# EAGLE design buckler (EAGLE 9.1.1)
AUTHOR: Branden Ghena; REV: B; TITLE: Berkeley Buckler

## Sheet 1 of 3: Headers
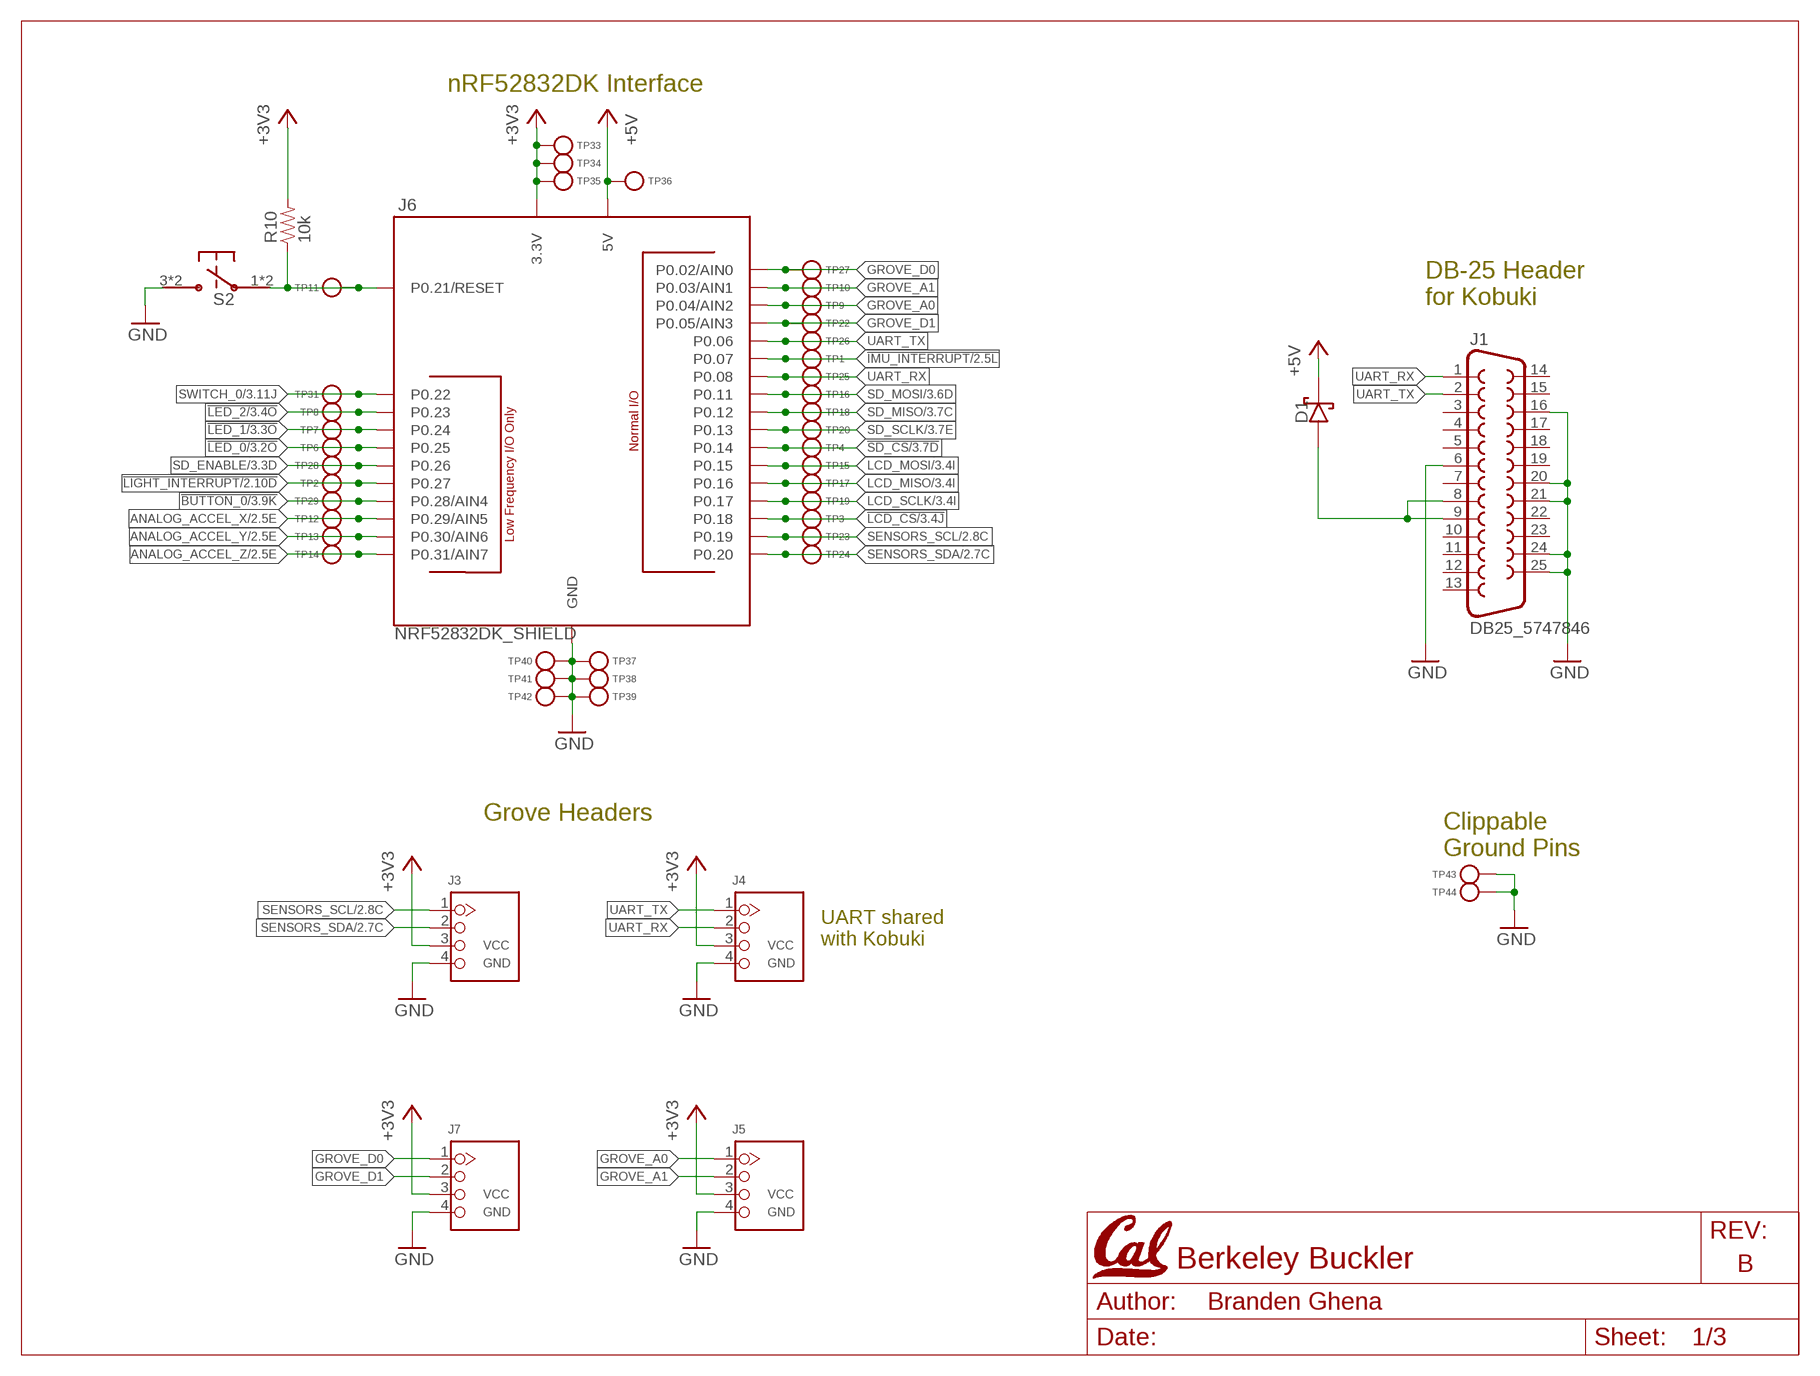
[diagram p0: schematic, sheet 1]
U$1 (LETTER_L_CAL): HEIGHT: 8.5in; WIDTH: 11in

### Parts
D1  DIODE_SCHOTTKYSOD323  [SOD323]
J1  DB25_5747846  [DB25_5747846]
J3  4P-2.0  GROVE-CONNECTOR-DIP(4P-2.0)  [HW4-2.0]
J4  4P-2.0  GROVE-CONNECTOR-DIP(4P-2.0)  [HW4-2.0]
J5  4P-2.0  GROVE-CONNECTOR-DIP(4P-2.0)  [HW4-2.0]
J6  NRF52832DK_SHIELD  [NRF52832DK_SHIELD]
J7  4P-2.0  GROVE-CONNECTOR-DIP(4P-2.0)  [HW4-2.0]
R10  10k  RESISTOR0402_RES  [0402_RES]
S2  PTS645SM43SMTR92  [PTS645]
TP1  TEST_POINT_0.040IN  [TESTPOINT_0.040IN]
TP2  TEST_POINT_0.040IN  [TESTPOINT_0.040IN]
TP3  TEST_POINT_0.040IN  [TESTPOINT_0.040IN]
TP4  TEST_POINT_0.040IN  [TESTPOINT_0.040IN]
TP6  TEST_POINT_0.040IN  [TESTPOINT_0.040IN]
TP7  TEST_POINT_0.040IN  [TESTPOINT_0.040IN]
TP8  TEST_POINT_0.040IN  [TESTPOINT_0.040IN]
TP9  TEST_POINT_0.040IN  [TESTPOINT_0.040IN]
TP10  TEST_POINT_0.040IN  [TESTPOINT_0.040IN]
TP11  TEST_POINT_0.040IN  [TESTPOINT_0.040IN]
TP12  TEST_POINT_0.040IN  [TESTPOINT_0.040IN]
TP13  TEST_POINT_0.040IN  [TESTPOINT_0.040IN]
TP14  TEST_POINT_0.040IN  [TESTPOINT_0.040IN]
TP15  TEST_POINT_0.040IN  [TESTPOINT_0.040IN]
TP16  TEST_POINT_0.040IN  [TESTPOINT_0.040IN]
TP17  TEST_POINT_0.040IN  [TESTPOINT_0.040IN]
TP18  TEST_POINT_0.040IN  [TESTPOINT_0.040IN]
TP19  TEST_POINT_0.040IN  [TESTPOINT_0.040IN]
TP20  TEST_POINT_0.040IN  [TESTPOINT_0.040IN]
TP22  TEST_POINT_0.040IN  [TESTPOINT_0.040IN]
TP23  TEST_POINT_0.040IN  [TESTPOINT_0.040IN]
TP24  TEST_POINT_0.040IN  [TESTPOINT_0.040IN]
TP25  TEST_POINT_0.040IN  [TESTPOINT_0.040IN]
TP26  TEST_POINT_0.040IN  [TESTPOINT_0.040IN]
TP27  TEST_POINT_0.040IN  [TESTPOINT_0.040IN]
TP28  TEST_POINT_0.040IN  [TESTPOINT_0.040IN]
TP29  TEST_POINT_0.040IN  [TESTPOINT_0.040IN]
TP31  TEST_POINT_0.040IN  [TESTPOINT_0.040IN]
TP33  TEST_POINT_0.040IN  [TESTPOINT_0.040IN]
TP34  TEST_POINT_0.040IN  [TESTPOINT_0.040IN]
TP35  TEST_POINT_0.040IN  [TESTPOINT_0.040IN]
TP36  TEST_POINT_0.040IN  [TESTPOINT_0.040IN]
TP37  TEST_POINT_0.040IN  [TESTPOINT_0.040IN]
TP38  TEST_POINT_0.040IN  [TESTPOINT_0.040IN]
TP39  TEST_POINT_0.040IN  [TESTPOINT_0.040IN]
TP40  TEST_POINT_0.040IN  [TESTPOINT_0.040IN]
TP41  TEST_POINT_0.040IN  [TESTPOINT_0.040IN]
TP42  TEST_POINT_0.040IN  [TESTPOINT_0.040IN]
TP43  TEST_POINT_0.078IN  [TESTPOINT_0.078IN]
TP44  TEST_POINT_0.078IN  [TESTPOINT_0.078IN]

### Nets
5V_IN: D1.P$2(ANODE) J1.8 J1.9
!BUTTON_0: J6.P0.28(P0.28/AIN4) TP29.TESTPOINT ; also sheet 3
!IMU_INTERRUPT: J6.P0.07 TP1.TESTPOINT ; also sheet 2
!LCD_CS: J6.P0.18 TP3.TESTPOINT ; also sheet 3
!LED_0: J6.P0.25 TP6.TESTPOINT ; also sheet 3
!LED_1: J6.P0.24 TP7.TESTPOINT ; also sheet 3
!LED_2: J6.P0.23 TP8.TESTPOINT ; also sheet 3
!LIGHT_INTERRUPT: J6.P0.27 TP2.TESTPOINT ; also sheet 2
!RESET: J6.P0.21(P0.21/RESET) R10.1 S2.1 S2.2 TP11.TESTPOINT
!SD_CS: J6.P0.14 TP4.TESTPOINT ; also sheet 3
+3V3: J3.3 J4.3 J5.3 J6.3.3V@0(3.3V) J6.3.3V@1(3.3V) J6.3.3V@2(3.3V) J7.3 R10.2 TP33.TESTPOINT TP34.TESTPOINT TP35.TESTPOINT ; also sheet 2,3
+5V: D1.P$1(CATHODE) J6.5V TP36.TESTPOINT
ANALOG_ACCEL_X: J6.P0.29(P0.29/AIN5) TP12.TESTPOINT ; also sheet 2
ANALOG_ACCEL_Y: J6.P0.30(P0.30/AIN6) TP13.TESTPOINT ; also sheet 2
ANALOG_ACCEL_Z: J6.P0.31(P0.31/AIN7) TP14.TESTPOINT ; also sheet 2
GND: J1.6 J1.16 J1.20 J1.21 J1.24 J1.25 J3.4 J4.4 J5.4 J6.GND@0(GND) J6.GND@1(GND) J6.GND@2(GND) J7.4 S2.3 S2.4 TP37.TESTPOINT TP38.TESTPOINT TP39.TESTPOINT TP40.TESTPOINT TP41.TESTPOINT TP42.TESTPOINT TP43.1(TESTPOINT) TP44.1(TESTPOINT) ; also sheet 2,3
GROVE_A0: J5.1 J6.P0.04(P0.04/AIN2) TP9.TESTPOINT
GROVE_A1: J5.2 J6.P0.03(P0.03/AIN1) TP10.TESTPOINT
GROVE_D0: J6.P0.02(P0.02/AIN0) J7.1 TP27.TESTPOINT
GROVE_D1: J6.P0.05(P0.05/AIN3) J7.2 TP22.TESTPOINT
LCD_MISO: J6.P0.16 TP17.TESTPOINT ; also sheet 3
LCD_MOSI: J6.P0.15 TP15.TESTPOINT ; also sheet 3
LCD_SCLK: J6.P0.17 TP19.TESTPOINT ; also sheet 3
SD_ENABLE: J6.P0.26 TP28.TESTPOINT ; also sheet 3
SD_MISO: J6.P0.12 TP18.TESTPOINT ; also sheet 3
SD_MOSI: J6.P0.11 TP16.TESTPOINT ; also sheet 3
SD_SCLK: J6.P0.13 TP20.TESTPOINT ; also sheet 3
SENSORS_SCL: J3.1 J6.P0.19 TP23.TESTPOINT ; also sheet 2
SENSORS_SDA: J3.2 J6.P0.20 TP24.TESTPOINT ; also sheet 2
SWITCH_0: J6.P0.22 TP31.TESTPOINT ; also sheet 3
UART_RX: J1.1 J4.2 J6.P0.08 TP25.TESTPOINT
UART_TX: J1.2 J4.1 J6.P0.06 TP26.TESTPOINT
Unconnected: J1.3 J1.4 J1.5 J1.7 J1.10 J1.11 J1.12 J1.13 J1.14 J1.15 J1.17 J1.18 J1.19 J1.22 J1.23

### Notes on the sheet
- nRF52832DK Interface
- DB-25 Header
  for Kobuki
- Grove Headers
- Clippable
  Ground Pins
- UART shared
  with Kobuki

## Sheet 2 of 3: Sensors
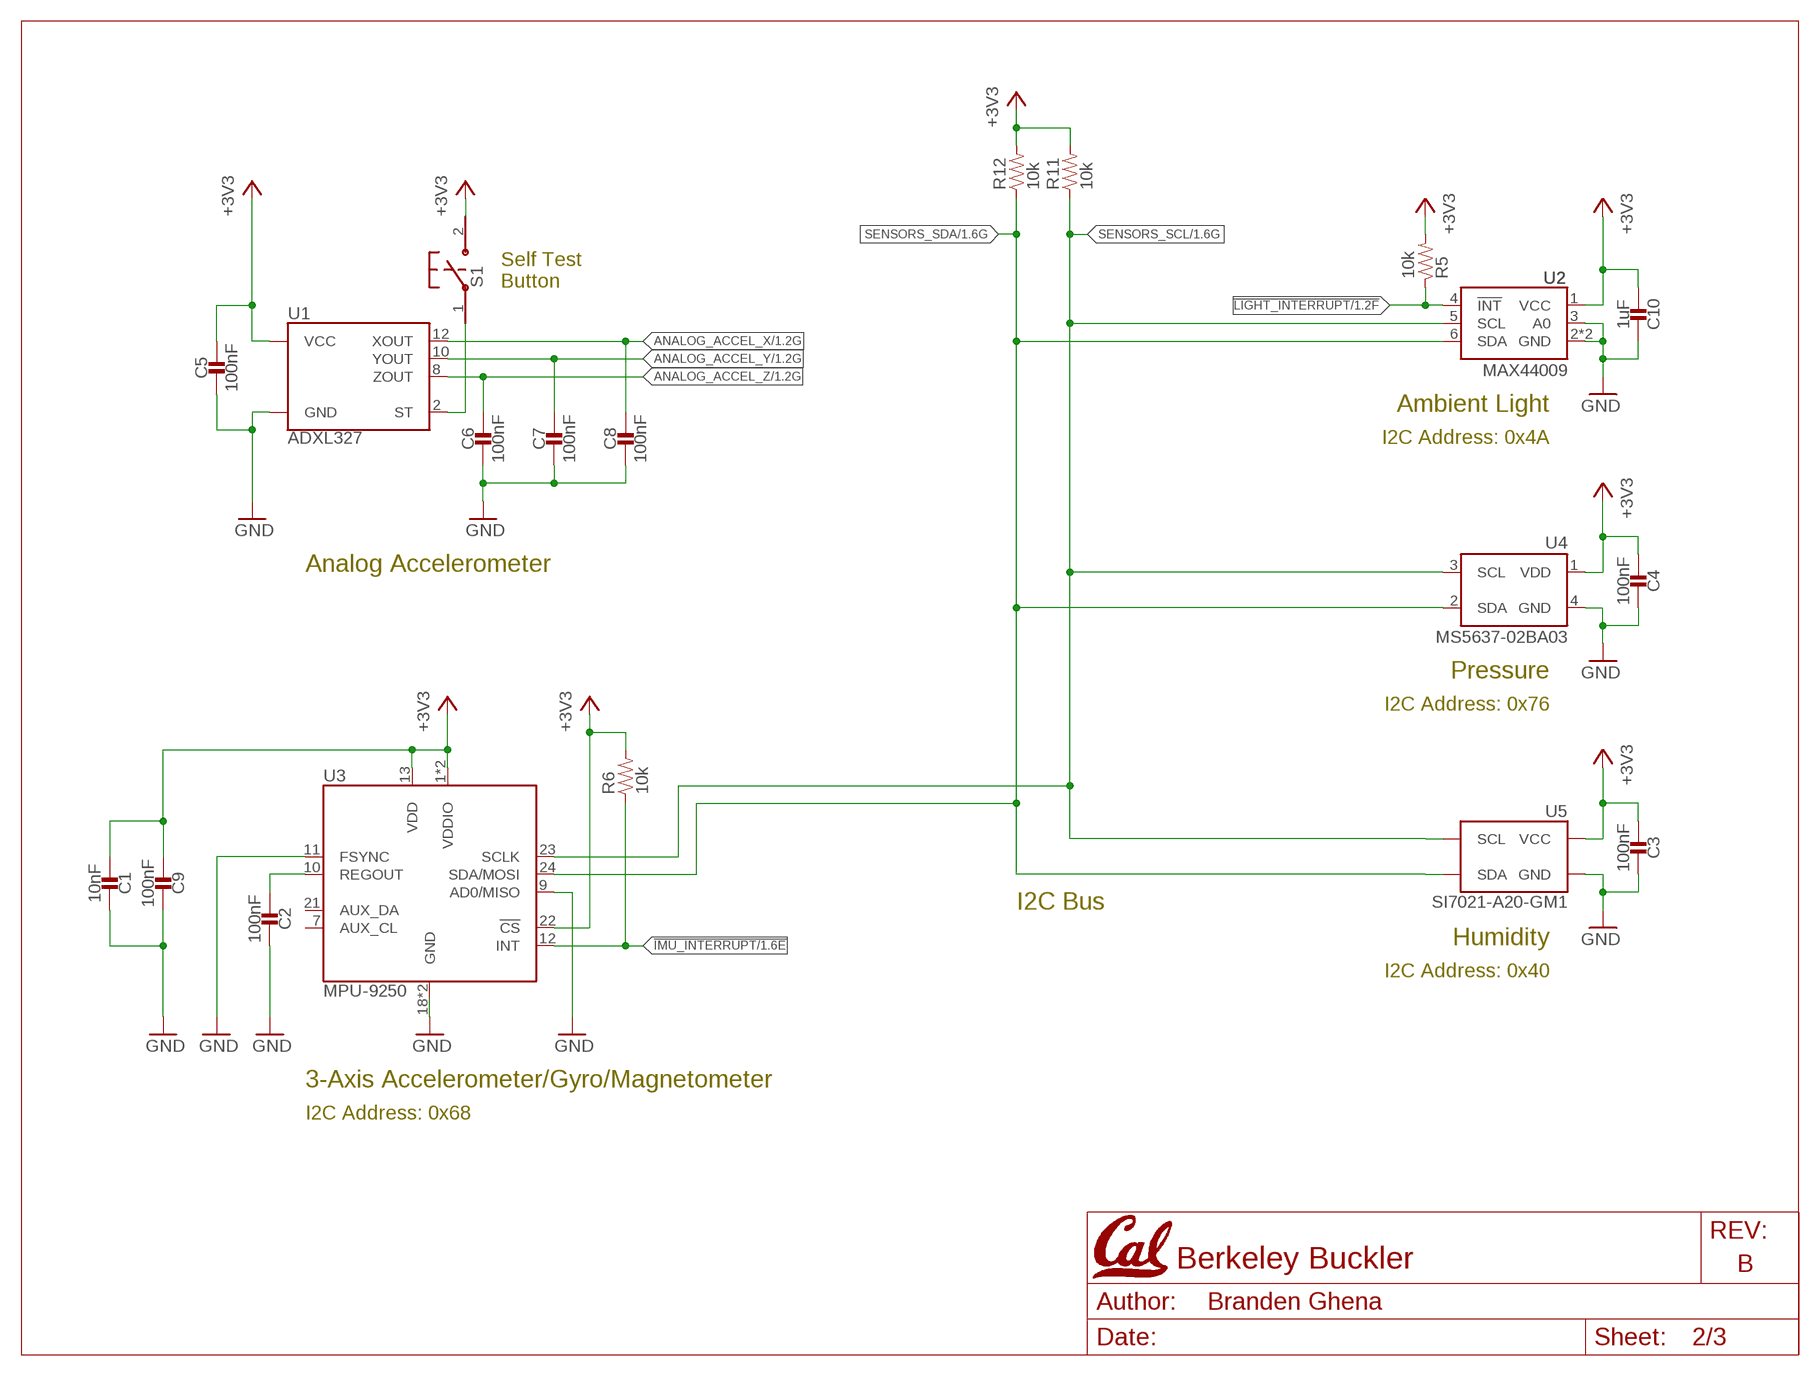
[diagram p1: schematic, sheet 2]
U$2 (LETTER_L_CAL): HEIGHT: 8.5in; WIDTH: 11in

### Parts
C1  10nF  CAPACITOR0402_CAP  [0402_CAP]
C2  100nF  CAPACITOR0402_CAP  [0402_CAP]
C3  100nF  CAPACITOR0402_CAP  [0402_CAP]
C4  100nF  CAPACITOR0402_CAP  [0402_CAP]
C5  100nF  CAPACITOR0402_CAP  [0402_CAP]
C6  100nF  CAPACITOR0402_CAP  [0402_CAP]
C7  100nF  CAPACITOR0402_CAP  [0402_CAP]
C8  100nF  CAPACITOR0402_CAP  [0402_CAP]
C9  100nF  CAPACITOR0402_CAP  [0402_CAP]
C10  1uF  CAPACITOR0402_CAP  [0402_CAP]
R5  10k  RESISTOR0402_RES  [0402_RES]
R6  10k  RESISTOR0402_RES  [0402_RES]
R11  10k  RESISTOR0402_RES  [0402_RES]
R12  10k  RESISTOR0402_RES  [0402_RES]
S1  B3U-1000P  [B3U-1000P]
U1  ADXL327  [LFCSP-16]
U2  MAX44009  [UDFN-6-EXPOSED]
U3  MPU-9250  [QFN-24/3MM]
U4  MS5637-02BA03  [4-SMD]
U5  SI7021-A20-GM1  [DFN-6/3MM]

### Nets
!IMU_INTERRUPT: R6.1 U3.12(INT) ; also sheet 1
!LIGHT_INTERRUPT: R5.1 U2.4(!INT) ; also sheet 1
+3V3: C1.1 C3.1 C4.1 C5.1 C9.1 C10.1 R5.2 R6.2 R11.2 R12.2 S1.2 U1.14(VCC) U1.15(VCC) U2.1(VCC) U3.1(VDDIO) U3.8(VDDIO) U3.13(VDD) U3.22(!CS) U4.1(VDD) U5.5(VCC) ; also sheet 1,3
ANALOG_ACCEL_X: C8.1 U1.12(XOUT) ; also sheet 1
ANALOG_ACCEL_Y: C7.1 U1.10(YOUT) ; also sheet 1
ANALOG_ACCEL_Z: C6.1 U1.8(ZOUT) ; also sheet 1
GND: C1.2 C2.2 C3.2 C4.2 C5.2 C6.2 C7.2 C8.2 C9.2 C10.2 U1.3(GND) U1.5(GND) U1.6(GND) U1.7(GND) U2.2(GND) U2.3(A0) U2.EP(GND) U3.9(AD0/MISO) U3.11(FSYNC) U3.18(GND) U3.20(GND) U4.4(GND) U5.2(GND) ; also sheet 1,3
N$7: S1.1 U1.2(ST)
N$19: C2.1 U3.10(REGOUT)
SENSORS_SCL: R11.1 U2.5(SCL) U3.23(SCLK) U4.3(SCL) U5.6(SCL) ; also sheet 1
SENSORS_SDA: R12.1 U2.6(SDA) U3.24(SDA/MOSI) U4.2(SDA) U5.1(SDA) ; also sheet 1
Unconnected: U3.7(AUX_CL) U3.21(AUX_DA)

### Notes on the sheet
- Self Test
  Button
- Ambient Light
- I2C Address: 0x4A
- Analog Accelerometer
- Pressure
- I2C Address: 0x76
- I2C Bus
- Humidity
- I2C Address: 0x40
- 3-Axis Accelerometer/Gyro/Magnetometer
- I2C Address: 0x68

## Sheet 3 of 3: Other Peripherals
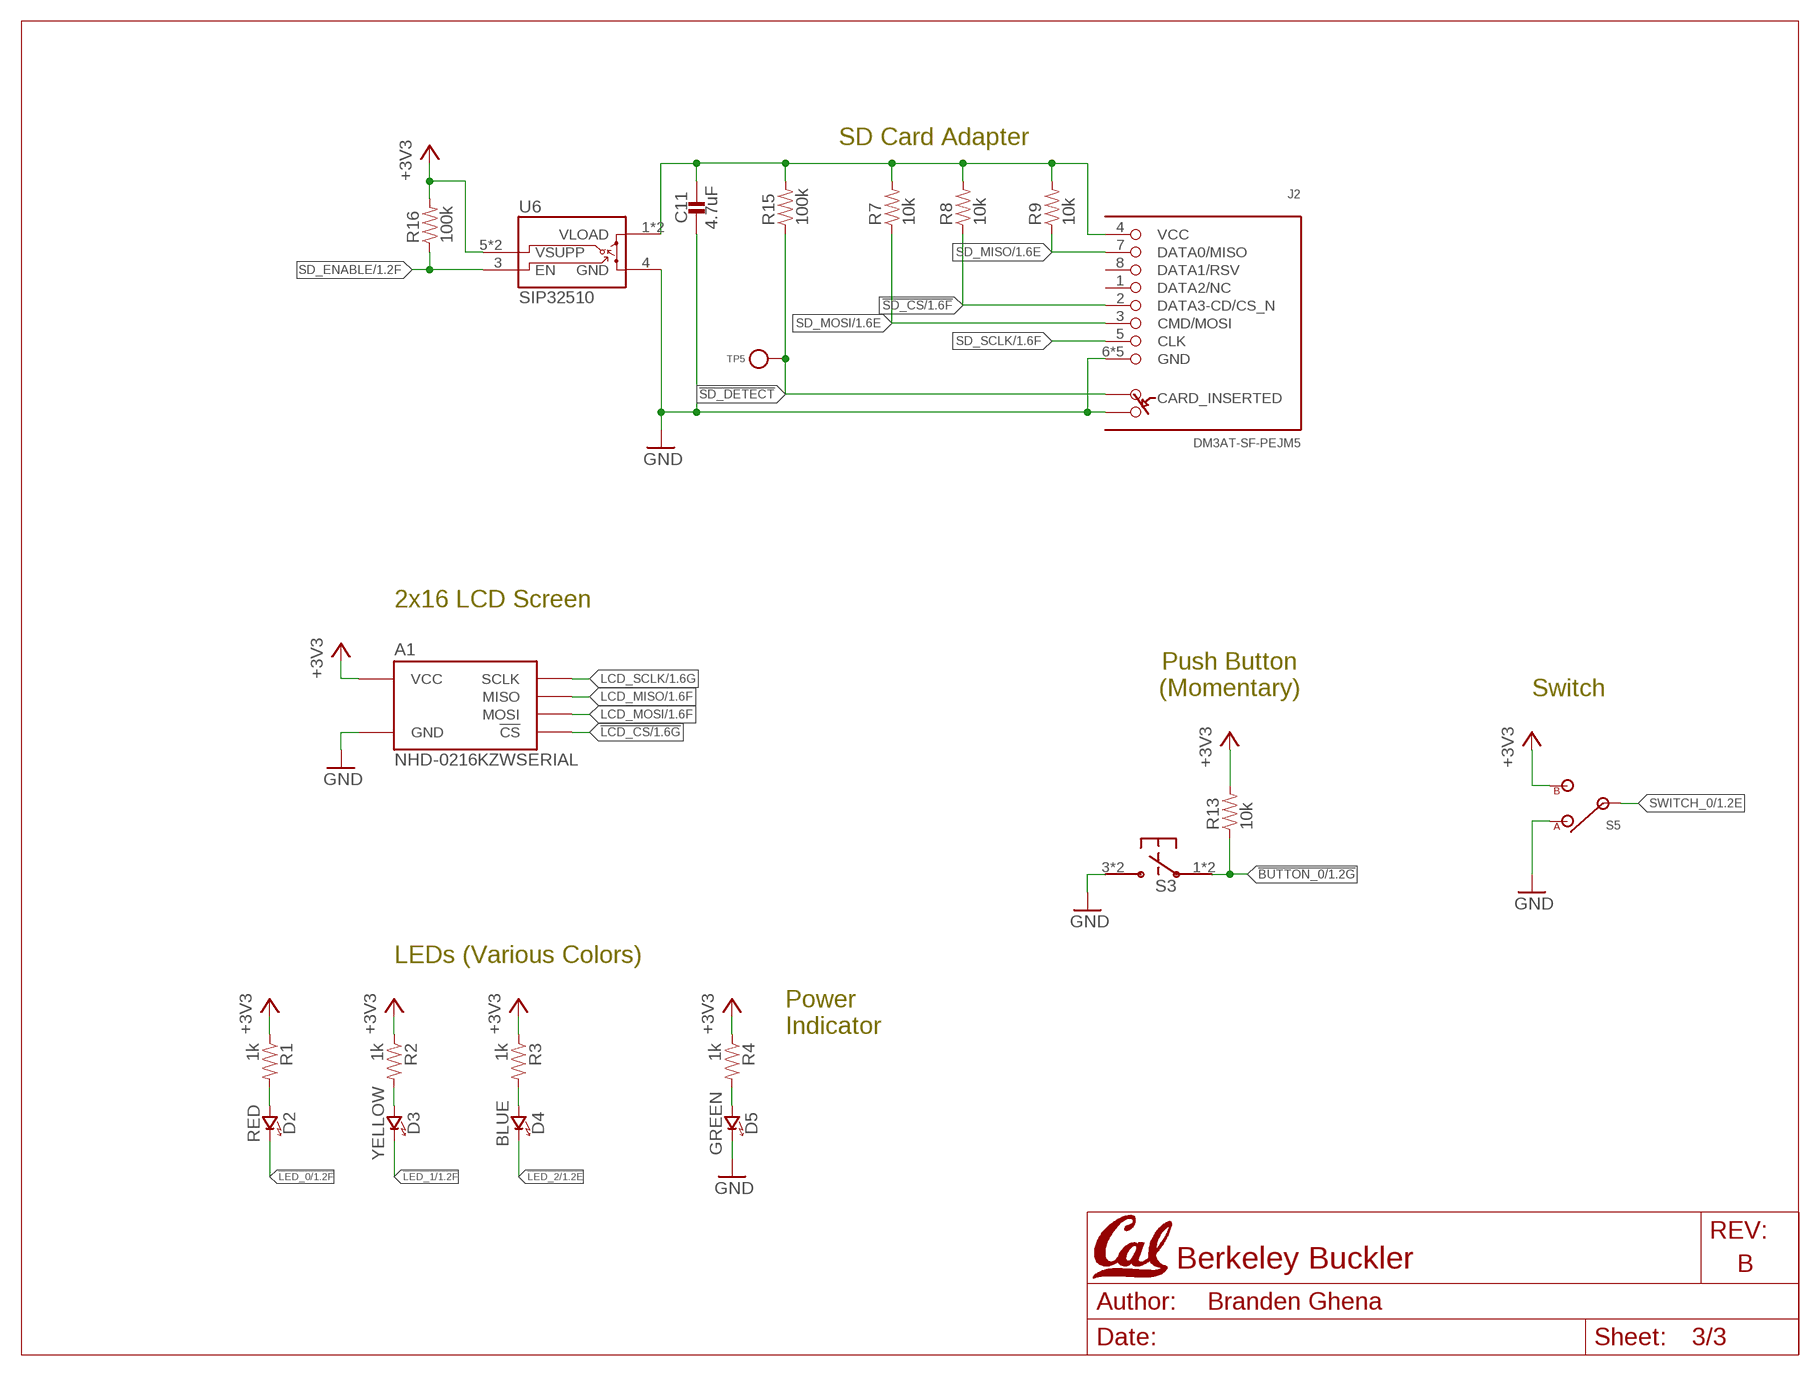
[diagram p2: schematic, sheet 3]
U$3 (LETTER_L_CAL): HEIGHT: 8.5in; WIDTH: 11in

### Parts
A1  NHD-0216KZWSERIAL  [NHD-0216KZW]
C11  4.7uF  CAPACITOR0402_CAP  [0402_CAP]
D2  RED  LED0603  [LED-0603]
D3  YELLOW  LED0603  [LED-0603]
D4  BLUE  LED0603  [LED-0603]
D5  GREEN  LED0603  [LED-0603]
J2  DM3AT-SF-PEJM5  [DM3AT-SF-PEJM5]
R1  1k  RESISTOR0402_RES  [0402_RES]
R2  1k  RESISTOR0402_RES  [0402_RES]
R3  1k  RESISTOR0402_RES  [0402_RES]
R4  1k  RESISTOR0402_RES  [0402_RES]
R7  10k  RESISTOR0402_RES  [0402_RES]
R8  10k  RESISTOR0402_RES  [0402_RES]
R9  10k  RESISTOR0402_RES  [0402_RES]
R13  10k  RESISTOR0402_RES  [0402_RES]
R15  100k  RESISTOR0402_RES  [0402_RES]
R16  100k  RESISTOR0402_RES  [0402_RES]
S3  PTS645SM43SMTR92  [PTS645]
S5  TE_SSA12/SPDT  [TE_SSA12/SPDT]
TP5  TEST_POINT_0.040IN  [TESTPOINT_0.040IN]
U6  SIP32510  [TSOT23-6]

### Nets
!BUTTON_0: R13.1 S3.1 S3.2 ; also sheet 1
!LCD_CS: A1.16(!CS) ; also sheet 1
!LED_0: D2.C(CATHODE) ; also sheet 1
!LED_1: D3.C(CATHODE) ; also sheet 1
!LED_2: D4.C(CATHODE) ; also sheet 1
!SD_CS: J2.2(DATA3-CD/CS_N) R8.1 ; also sheet 1
!SD_DETECT: J2.A R15.1 TP5.TESTPOINT
+3V3: A1.2(VCC) R1.1 R2.1 R3.1 R4.1 R13.2 R16.2 S5.2(B) U6.5(VSUPP) U6.6(VSUPP) ; also sheet 1,2
GND: A1.1(GND) C11.2 D5.C(CATHODE) J2.6(GND) J2.B J2.MOUNT0(GND) J2.MOUNT1(GND) J2.MOUNT2(GND) J2.MOUNT3(GND) S3.3 S3.4 S5.1(A) U6.4(GND) ; also sheet 1,2
LCD_MISO: A1.13(MISO) ; also sheet 1
LCD_MOSI: A1.14(MOSI) ; also sheet 1
LCD_SCLK: A1.12(SCLK) ; also sheet 1
N$3: D5.A(ANODE) R4.2
N$4: D4.A(ANODE) R3.2
N$5: D3.A(ANODE) R2.2
N$18: C11.1 J2.4(VCC) R7.2 R8.2 R9.2 R15.2 U6.1(VLOAD) U6.2(VLOAD)
N$25: D2.A(ANODE) R1.2
SD_ENABLE: R16.1 U6.3(EN) ; also sheet 1
SD_MISO: J2.7(DATA0/MISO) R9.1 ; also sheet 1
SD_MOSI: J2.3(CMD/MOSI) R7.1 ; also sheet 1
SD_SCLK: J2.5(CLK) ; also sheet 1
SWITCH_0: S5.IN ; also sheet 1
Unconnected: J2.1(DATA2/NC) J2.8(DATA1/RSV)

### Notes on the sheet
- SD Card Adapter
- 2x16 LCD Screen
- Push Button
  (Momentary)
- Switch
- LEDs (Various Colors)
- Power
  Indicator

## Library data of the parts
A1 = headers:NHD-0216KZW; DIGIKEY: NHD-0216KZW-AG5-ND,952-3305-ND; DIGIKEY1: NHD-0216KZW-AG5-ND; DIGIKEY2: 952-3305-ND
C1 = passives:CAPACITOR: SMD Capacitor; DESCRIPTION: CAP CER 10000PF 25V X7R 0402; DIGIKEY: 399-1279-1-ND; MANUFACTURER: KEMET; MPN: C0402C103J3RACTU
C2-C9 = passives:CAPACITOR: SMD Capacitor; DESCRIPTION: CAP CER 0.1UF 16V X7R 0402; DIGIKEY: 490-4759-1-ND; MANUFACTURER: Murata; MPN: GCM155R71C104KA55D
C10 = passives:CAPACITOR: SMD Capacitor; DESCRIPTION: CAP CER 1UF 10V X6S 0402; DIGIKEY: 1276-6805-1-ND; MANUFACTURER: Samsung Electro-Mechanics; MPN: CL05X105KP5NNNC
C11 = passives:CAPACITOR: SMD Capacitor; DESCRIPTION: CAP CER 4.7UF 10V X5R 0402; DIGIKEY: 1276-1480-1-ND; MANUFACTURER: Samsung Electro-Mechanics; MPN: CL05A475KP5NRNC
D1 = passives:DIODE_SCHOTTKY; DESCRIPTION: DIODE SCHOTTKY 30V 500MA SOD323; DIGIKEY: B0530WS-FDICT-ND; MANUFACTURER: Diodes Incorporated; MPN: B0530WS-7-F
D2 = leds:LED: LED; DESCRIPTION: LED RED CLEAR CHIP SMD; DIGIKEY: 160-1436-1-ND; MANUFACTURER: Lite-On Inc.; MPN: LTST-C190KRKT
D3 = leds:LED: LED; DESCRIPTION: LED YELLOW CLEAR CHIP SMD; DIGIKEY: 160-1437-1-ND; MANUFACTURER: Lite-On Inc.; MPN: LTST-C190KSKT
D4 = leds:LED: LED; DESCRIPTION: LED BLUE CLEAR SMD; DIGIKEY: 160-1837-1-ND; MANUFACTURER: Lite-On Inc.; MPN: LTST-C194TBKT
D5 = leds:LED: LED; DESCRIPTION: LED GREEN CLEAR CHIP SMD; DIGIKEY: 160-1435-1-ND; MANUFACTURER: Lite-On Inc.; MPN: LTST-C190KGKT
J1 = headers:DB25_5747846; DESCRIPTION: CONN D-SUB RCPT 25POS R/A SOLDER; DIGIKEY: A32126-ND; MANUFACTURER: TE Connectivity AMP Connectors; MPN: 5747846-4
J2 = connector:DM3AT-SF-PEJM5: CONN MICRO SD R/A PUSH-PUSH SMD; DESCRIPTION: CONN MICRO SD CARD PUSH-PUSH R/A; DIGIKEY: HR1964CT-ND; MANUFACTURER: Hirose Electric Co Ltd; MPN: DM3AT-SF-PEJM5
J3-J5 J7 = headers:GROVE-CONNECTOR-DIP(4P-2.0): 320110033; DESCRIPTION: Grove - Universal 4 pin connector; MANUFACTURER: Seeed Studio; MOUSER: 713-110990030; MPN: 110990030
J6 = headers:NRF52832DK_SHIELD: Shield for the PCA10040 nRF52832 Development Kit
R1-R4 = passives:RESISTOR: Resistor Basic schematic elements and footprints for 0201, 0402, 0603, 1206, and PTH resistors.; DESCRIPTION: RES SMD 1K OHM 1% 1/16W 0402; DIGIKEY: RMCF0402FT1K00CT-ND; MANUFACTURER: Stackpole Electronics; MPN: RMCF0402FT1K00
R5-R13 = passives:RESISTOR: Resistor Basic schematic elements and footprints for 0201, 0402, 0603, 1206, and PTH resistors.; DESCRIPTION: RES SMD 10K OHM 1% 1/16W 0402; DIGIKEY: 1276-3431-1-ND; MANUFACTURER: Samsung Electro-Mechanics; MPN: RC1005F103CS
R15 R16 = passives:RESISTOR: Resistor Basic schematic elements and footprints for 0201, 0402, 0603, 1206, and PTH resistors.; DESCRIPTION: RES SMD 100K OHM 1% 1/5W 0402; DIGIKEY: 541-100KYCT-ND; MANUFACTURER: Vishay Dale; MPN: CRCW0402100KFKEDHP
S1 = switches:B3U: Switch; DESCRIPTION: SWITCH TACTILE SPST-NO 0.05A 12V; DIGIKEY: SW1020CT-ND; MANUFACTURER: Omron; MPN: B3U-1000P
S2 S3 = switches:PTS645SM43SMTR92: Tactile Switch SPST-NO Top Actuated Surface Mount; DESCRIPTION: SWITCH TACTILE SPST-NO 0.05A 12V; DIGIKEY: CKN9112CT-ND; MANUFACTURER: C&K; MPN: PTS645SM43SMTR92 LFS
S5 = switches:TE_SSA12/SPDT: SWITCH SLIDE SPDT 2POS SSA SER; DESCRIPTION: SWITCH SLIDE SPDT 100MA 30V; DIGIKEY: 450-1602-ND; MANUFACTURER: TE Connectivity ALCOSWITCH Switches; MPN: SSA12
TP1-TP20 TP22-TP29 TP31 TP33-TP42 = headers:TEST_POINT_0.040IN: 0.040in Test Point; DIGIKEY: 5001K-ND
TP43 TP44 = headers:TEST_POINT_0.078IN; DESCRIPTION: TERM TURRET SINGLE L=4.75MM TIN; DIGIKEY: 36-1520-2-ND; MANUFACTURER: Keystone Electronics; MPN: 1520-2
U1 = chips:ADXL327: ADXL327 3-Axis Analog Accelerometer; DESCRIPTION: ACCELEROMETER 2G ANALOG 16LFCSP; DIGIKEY: ADXL327BCPZ-ND; MANUFACTURER: Analog Devices Inc.; MPN: ADXL327BCPZ
U2 = chips:MAX44009: low power ambient light sensor; DESCRIPTION: SENSOR AMBIENT LIGHT 6UTDFN; DIGIKEY: MAX44009EDT+TCT-ND; MANUFACTURER: Maxim Integrated; MPN: MAX44009EDT+T
U3 = chips:MPU-9250: GYRO/ACCEL/COMPASS/9-AXIS; DESCRIPTION: IMU ACCEL/GYRO/MAG I2C/SPI 24QFN; DIGIKEY: 1428-1019-1-ND; MANUFACTURER: TDK InvenSense; MPN: MPU-9250
U4 = chips:MS5637-02BA03: low power pressure sensor; DESCRIPTION: SENSOR 17.4PSIA I2C 24B 4-QFN; DIGIKEY: 223-1199-1-ND; MANUFACTURER: TE CONNECTIVITY; MPN: MS563702BA03-50
U5 = chips:SI7021: IC TEMP SENSOR RH 2% DFN; DESCRIPTION: SENS HUMI/TEMP 3.6V I2C 3% 6DFN; DIGIKEY: 336-3141-ND; MANUFACTURER: Silicon Labs; MOUSER: 634-SI7021-A20-GM1; MPN: SI7021-A20-GM1
U6 = chips:SIP32510: Load switch, slew rate controlled. By Vishay; DESCRIPTION: IC LOAD SWITCH SOT23-6; DIGIKEY: SIP32510DT-T1-GE3CT-ND; MANUFACTURER: Vishay; MPN: SIP32510DT-T1-GE3

## Board
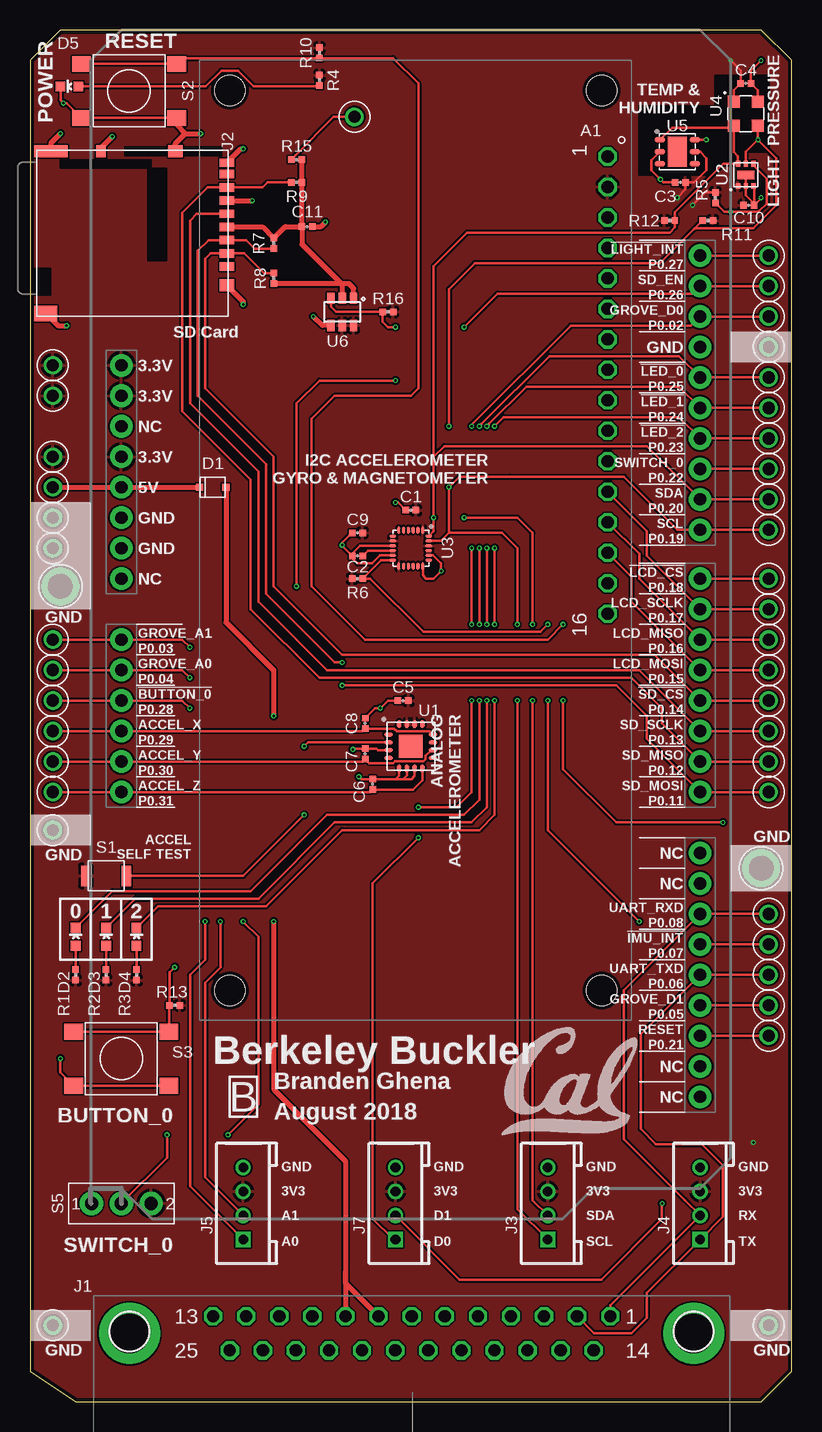
[diagram p3: board, top side]
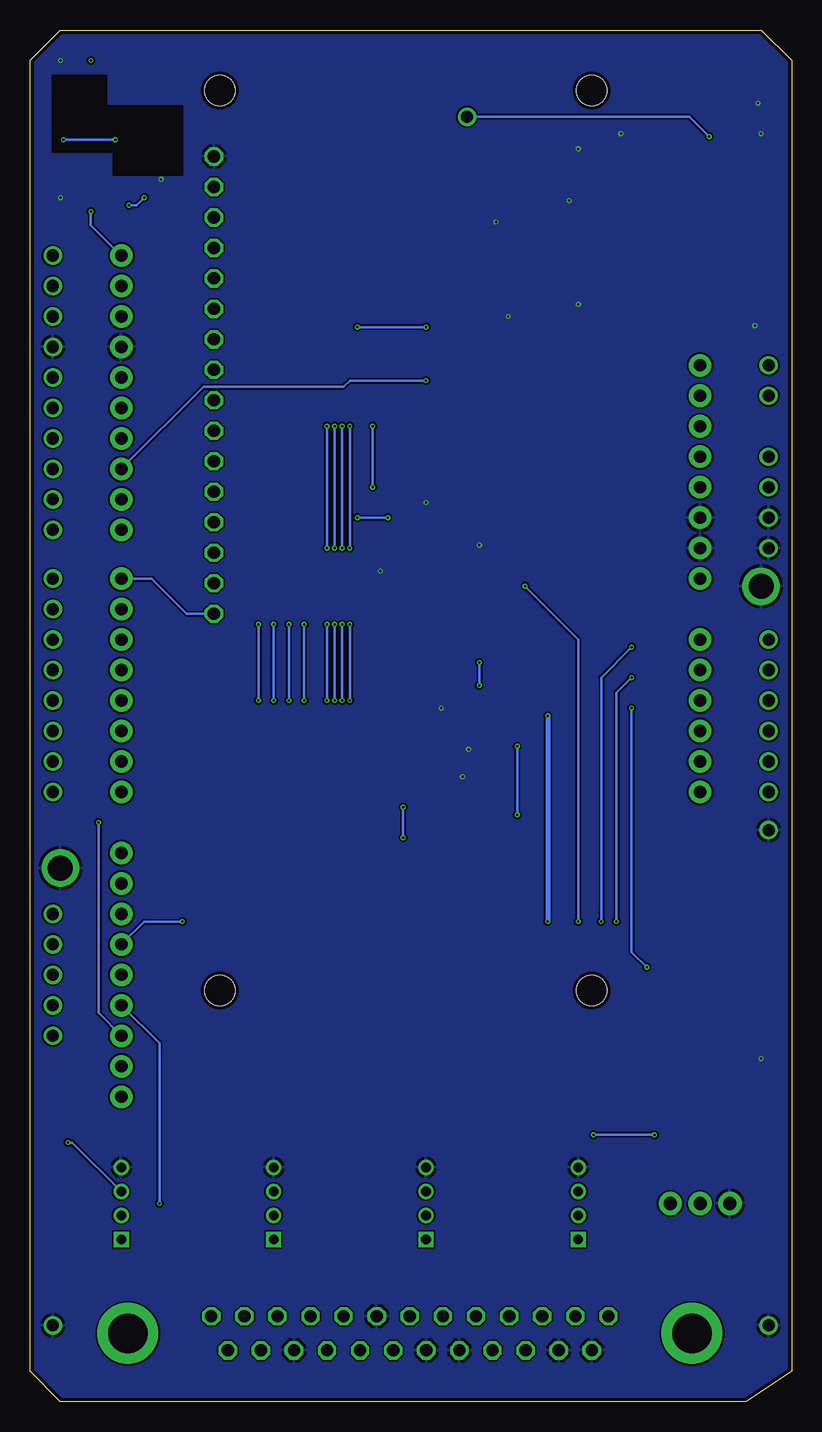
[diagram p4: board, bottom side, seen from below]

Size 63.5 x 114.3 mm. Coordinates in mm from the lower left corner, seen from the top.
Outline: 60.96,114.3 2.54,114.3 0,111.76 0,2.54 3.81,0 8.89,0 43.18,0 46.99,0 55.88,0 58.42,0 60.96,0 63.5,2.54 63.5,111.76 60.96,114.3
Copper layers (1*16): Top 0.0178mm / dielectric 59mil / Bottom 0.0178mm
Design rules "quickturn_co_kr_1oz": minimum track width 4mil, minimum drill 0.200659375mm, track to track 6mil, track to pad 6mil, pad to pad 6mil, via to via 6mil, smd to smd 6mil, copper to edge 12mil, drill to drill 12mil, minimum pad ring 8mil, minimum via ring 4mil, stop-mask expansion 3mil, vias tented up to drill 50mil, thermal gap 10mil

### Footprints (pad centres in the part's own frame; a part is rotated, then mirrored left to right if it is on the bottom)
NHD-0216KZW = drill 1.016 octagon: 1 8,-2; 2 10.54,-2; 3 13.08,-2; 4 15.62,-2; 5 18.16,-2; 6 20.7,-2; 7 23.24,-2; 8 25.78,-2; 9 28.32,-2; 10 30.86,-2; 11 33.4,-2; 12 35.94,-2; 13 38.48,-2; 14 41.02,-2; 15 43.56,-2; 16 46.1,-2 | hole 2.5: 2.5,-2.5; 2.5,-33.5; 77.5,-33.5; 77.5,-2.5
0402_CAP = smd 0.536 x 0.546: 1 -0.433,0; 2 0.433,0
SOD323 = smd 0.6 x 0.6: P$1 -1.1,0; P$2 1.1,0
LED-0603 = smd 0.8 x 0.8: A 0,-0.75; C 0,0.75
DB25_5747846 = drill 1.016 octagon: 1 0,0; 2 2.76,0; 3 5.52,0; 4 8.28,0; 5 11.041,0; 6 13.801,0; 7 16.561,0; 8 19.321,0; 9 22.081,0; 10 24.841,0; 11 27.601,0; 12 30.362,0; 13 33.122,0; 14 1.379,2.845; 15 4.139,2.845; 16 6.898,2.845; 17 9.657,2.845; 18 12.417,2.845; 19 15.176,2.845; 20 17.935,2.845; 21 20.695,2.845; 22 23.454,2.845; 23 26.213,2.845; 24 28.973,2.845; 25 31.732,2.845 | drill 3.302 pad 5.08: G1 -6.96,1.422; G2 40.081,1.422
DM3AT-SF-PEJM5 = smd 0.7 x 1.2: 1 3.2,-0.1; 2 2.1,-0.1; 3 1,-0.1; 4 -0.1,-0.1; 5 -1.2,-0.1; 6 -2.3,-0.1; 7 -3.4,-0.1; 8 -4.5,-0.1; B -5.45,-0.1 | smd 1 x 0.8: A -6.4,-10.6 | smd 1 x 1.2: MOUNT0 4.75,-0.1; MOUNT1 -6.4,-4.4 | smd 1 x 2.8: MOUNT2 -6.4,-14.75 | smd 1.3 x 1.9: MOUNT3 7.1,-15.2
HW4-2.0 = drill 0.8 pad 1.27 square: 1 -3,0 | drill 0.8 pad 1.27: 2 -1,0; 3 1,0; 4 3,0
NRF52832DK_SHIELD = drill 1.016 pad 1.88: 3.3V@0 0,-7.62; 3.3V@1 0,-2.54; 3.3V@2 0,0; 5V 0,-10.16; !RESET 0,-5.08; GND@0 0,-12.7; GND@1 0,-15.24; GND@2 48.26,1.524; NC@0 0,-17.78; NC@1 48.26,-58.42; NC@2 48.26,-60.96; P0.02 48.26,4.064; P0.03 0,-22.86; P0.04 0,-25.4; P0.05 48.26,-53.34; P0.06 48.26,-50.8; P0.07 48.26,-48.26; P0.08 48.26,-45.72; P0.09 48.26,-43.18; P0.10 48.26,-40.64; P0.11 48.26,-35.56; P0.12 48.26,-33.02; P0.13 48.26,-30.48; P0.14 48.26,-27.94; P0.15 48.26,-25.4; P0.16 48.26,-22.86; P0.17 48.26,-20.32; P0.18 48.26,-17.78; P0.19 48.26,-13.716; P0.20 48.26,-11.176; P0.21 48.26,-55.88; P0.22 48.26,-8.636; P0.23 48.26,-6.096; P0.24 48.26,-3.556; P0.25 48.26,-1.016; P0.26 48.26,6.604; P0.27 48.26,9.144; P0.28 0,-27.94; P0.29 0,-30.48; P0.30 0,-33.02; P0.31 0,-35.56
0402_RES = smd 0.536 x 0.546: 1 -0.433,0; 2 0.433,0
B3U-1000P = smd 0.8 x 1.7: 1 -1.7,0; 2 1.7,0
PTS645 = smd 1.55 x 1.3: 1 -3.975,2.25; 2 3.975,2.25; 3 3.975,-2.25; 4 -3.975,-2.25
TE_SSA12/SPDT = drill 1.092 pad 1.93: 1 -2.489,0; 2 2.489,0; IN 0,0
TESTPOINT_0.040IN = drill 1.016: TESTPOINT 0,0
TESTPOINT_0.078IN = drill 2.083: 1 0,0
LFCSP-16 = smd 0.7 x 0.35: 1 -1.85,0.975; 2 -1.85,0.325; 3 -1.85,-0.325; 4 -1.85,-0.975; 9 1.85,-0.975; 10 1.85,-0.325; 11 1.85,0.325; 12 1.85,0.975 | smd 0.35 x 0.7: 5 -0.975,-1.85; 6 -0.325,-1.85; 7 0.325,-1.85; 8 0.975,-1.85; 13 0.975,1.85; 14 0.325,1.85; 15 -0.325,1.85; 16 -0.975,1.85 | smd 1.95 x 1.95: PAD 0,0
UDFN-6-EXPOSED = smd 0.48 x 0.36: 1 -0.925,0.65; 2 -0.925,0; 3 -0.925,-0.65; 4 0.925,-0.65; 5 0.925,0; 6 0.925,0.65 | smd 0.71 x 1.4: EP 0,0
QFN-24/3MM = smd 0.6 x 0.23: 1 -1.5,1; 2 -1.5,0.6; 3 -1.5,0.2; 4 -1.5,-0.2; 5 -1.5,-0.6; 6 -1.5,-1; 13 1.5,-1; 14 1.5,-0.6; 15 1.5,-0.2; 16 1.5,0.2; 17 1.5,0.6; 18 1.5,1 | smd 0.23 x 0.6: 7 -1,-1.5; 8 -0.6,-1.5; 9 -0.2,-1.5; 10 0.2,-1.5; 11 0.6,-1.5; 12 1,-1.5; 19 1,1.5; 20 0.6,1.5; 21 0.2,1.5; 22 -0.2,1.5; 23 -0.6,1.5; 24 -1,1.5
4-SMD = smd 1 x 1: 1 -1,1; 2 -1,-1; 3 1,-1; 4 1,1
DFN-6/3MM = smd 0.85 x 0.45: 1 -1.45,1; 2 -1.45,0; 3 -1.45,-1; 4 1.45,-1; 5 1.45,0; 6 1.45,1 | smd 1.6 x 2.5: P$1 0,0
TSOT23-6 = smd 0.6 x 0.927: 1 -0.95,-1.126; 2 0,-1.126; 3 0.95,-1.126; 4 0.95,1.126; 5 0,1.126; 6 -0.95,1.126

### Placement (x,y rotation side)
A1  50.16,111.76 270 top
C1  31.75,74.29 180 top
C2  27.3,70.48 180 top
C3  54.23,101.6 180 top
C4  59.69,109.85 0 top
C5  31.11,58.42 180 top
C6  28.57,51.44 90 top
C7  27.94,53.98 90 top
C8  27.94,56.52 90 top
C9  27.3,72.39 180 top
C10  59.94,99.69 0 top
C11  23.11,97.92 0 top
D1  15.24,76.2 0 top
D2  3.81,38.73 0 top
D3  6.35,38.73 0 top
D4  8.89,38.73 0 top
D5  3.3,109.6 90 top
J1  48.39,7.11 180 top
J2  16.51,97.79 270 top
J3  43.18,16.51 90 top
J4  55.88,16.51 90 top
J5  17.78,16.51 90 top
J6  7.62,86.36 0 top
J7  30.48,16.51 90 top
R1  3.81,35.56 90 top
R2  6.35,35.56 90 top
R3  8.89,35.56 90 top
R4  24.13,110.11 270 top
R5  57.15,100.33 90 top
R6  27.3,68.58 180 top
R7  20.32,96.52 90 top
R8  20.32,93.6 270 top
R9  22.23,101.6 0 top
R10  24.13,112.39 90 top
R11  56.52,98.42 0 top
R12  53.34,98.42 180 top
R13  12.06,33.02 0 top
R15  22.23,103.5 0 top
R16  29.84,90.8 0 top
S1  6.35,43.82 180 top
S2  8.26,109.22 0 top
S3  7.62,28.58 0 top
S5  7.62,16.51 0 top
TP1  61.59,38.1 0 top
TP2  61.59,95.5 0 top
TP3  61.59,68.58 0 top
TP4  61.59,58.42 0 top
TP5  27.05,107.06 0 top
TP6  61.59,85.34 0 top
TP7  61.59,82.8 0 top
TP8  61.59,80.26 0 top
TP9  1.91,60.96 0 top
TP10  1.91,63.5 0 top
TP11  61.59,30.48 0 top
TP12  1.91,55.88 0 top
TP13  1.91,53.34 0 top
TP14  1.91,50.8 0 top
TP15  61.59,60.96 0 top
TP16  61.59,50.8 0 top
TP17  61.59,63.5 0 top
TP18  61.59,53.34 0 top
TP19  61.59,66.04 0 top
TP20  61.59,55.88 0 top
TP22  61.59,33.02 0 top
TP23  61.59,72.64 0 top
TP24  61.59,75.18 0 top
TP25  61.59,40.64 0 top
TP26  61.59,35.56 0 top
TP27  61.59,90.42 0 top
TP28  61.59,92.96 0 top
TP29  1.91,58.42 0 top
TP31  61.59,77.72 0 top
TP33  1.91,86.36 0 top
TP34  1.91,83.82 0 top
TP35  1.91,78.74 0 top
TP36  1.91,76.2 0 top
TP37  1.91,73.66 0 top
TP38  1.91,71.12 0 top
TP39  61.59,87.88 0 top
TP40  61.59,6.35 0 top
TP41  1.91,6.35 0 top
TP42  1.91,47.62 0 top
TP43  60.96,44.45 0 top
TP44  2.54,67.94 0 top
U1  31.75,54.61 0 top
U2  59.69,102.23 90 top
U3  31.75,71.12 270 top
U4  59.69,107.31 0 top
U5  53.98,104.14 0 top
U6  26.04,90.8 180 top
U$5  [UCB_CAL_350MIL]  39.37,22.23 0 top

### Tracks (layer width: path | path; a pad name or v marks a point on that pad's centre or on a via)
5V_IN  (via drill 0.2)
  Top 0.406: D1.P$2 16.34,64.94 20.32,60.96 v20.32,57.15 | v20.32,40.01 20.32,26.03 26.31,20.05 26.31,10.79 | 26.31,10.79 J1.9 | J1.8 26.31,9.87 26.31,10.79
  Bottom 0.406: v20.32,57.15 v20.32,40.01
!BUTTON_0  (via drill 0.2)
  Top 0.203: TP29.TESTPOINT J6.P0.28 12.7,58.42 v13.34,57.79 | S3.1 S3.2 11.6,32.98 R13.1 11.63,35.76 v12.06,36.2
  Bottom 0.203: v13.34,57.79 13.34,37.46 v12.06,36.2
!IMU_INTERRUPT  (via drill 0.2)
  Top 0.203: J6.P0.07 TP1.TESTPOINT | U3.12 29.28,70.12 R6.1 28.37,68.58 32.82,64.13 42.55,64.13 v43.18,64.77 | v50.8,40.01 43.18,47.62 v43.18,58.42
  Bottom 0.203: J6.P0.07 53.98,40.01 v50.8,40.01 | v43.18,58.42 v43.18,64.77
!LCD_CS
  Top 0.203: TP3.TESTPOINT J6.P0.18
  Bottom 0.203: J6.P0.18 53.34,68.58 50.42,65.66 A1.16
!LED_0  (via drill 0.2)
  Top 0.203: TP6.TESTPOINT J6.P0.25 54.1,87.12 43.3,87.12 37.64,81.47 37.64,81.46 v37.47,81.28 | D2.C 6.87,42.55 18.41,42.55 24.77,48.9 36.2,48.9 37.47,50.16 v37.47,58.42 | v37.47,64.77 v37.47,71.12
  Bottom 0.203: v37.47,58.42 v37.47,64.77 | v37.47,71.12 v37.47,81.28
!LED_1  (via drill 0.2)
  Top 0.203: TP7.TESTPOINT J6.P0.24 54.1,84.58 41.39,84.58 38.28,81.47 38.28,81.46 v38.1,81.28 | D3.C 8.78,41.91 19.05,41.91 25.4,48.26 36.83,48.26 38.1,49.53 v38.1,58.42 | v38.1,64.77 v38.1,71.12
  Bottom 0.203: v38.1,58.42 v38.1,64.77 | v38.1,71.12 v38.1,81.28
!LED_2  (via drill 0.2)
  Top 0.203: TP8.TESTPOINT J6.P0.23 54.1,82.04 39.5,82.04 v38.73,81.28 | D4.C 10.68,41.27 19.68,41.27 26.04,47.62 37.47,47.62 38.73,48.9 v38.73,58.42 | v38.73,64.77 v38.73,71.12
  Bottom 0.203: v38.73,58.42 v38.73,64.77 | v38.73,71.12 v38.73,81.28
!LIGHT_INTERRUPT  (via drill 0.2)
  Top 0.203: J6.P0.27 TP2.TESTPOINT | U2.4 60.34,103 61.42,101.92 61.42,99.83 60.8,99.22 | 60.8,99.22 60.75,99.17 | 60.8,99.22 60.75,99.17 | 60.75,99.17 v58.42,99.17 57.88,99.17 R5.1
  Bottom 0.203: v58.42,99.17 58.42,98.04 J6.P0.27
!RESET  (via drill 0.2)
  Top 0.203: J6.P0.21 TP11.TESTPOINT | S2.1 S2.2 12.72,111.96 R10.1 30.28,111.96 32.38,109.85 32.38,84.45 31.75,83.82 25.4,83.82 23.5,81.91 23.5,67.94 27.94,63.5 43.18,63.5 v44.45,64.77 | v44.45,58.42 44.45,52.7 48.9,48.26 v57.78,48.26
  Bottom 0.203: v44.45,64.77 v44.45,58.42 | J6.P0.21 57.78,32.38 v57.78,48.26
!SD_CS
  Top 0.203: TP4.TESTPOINT J6.P0.14 52.07,62.23 26.04,62.23 20.32,67.94 20.32,78.74 14.61,84.45 14.61,95.25 15.04,95.69 J2.2 17.85,95.69 19.51,94.03 R8.1
!SD_DETECT  (via drill 0.2)
  Top 0.203: J2.A 5.91,104.46 | R15.1 22.14,103.85 22.14,103.88 25.31,107.06 TP5.TESTPOINT
  Top 0.406: 5.91,104.46 v6.86,105.41
  Bottom 0.203: v6.86,105.41 8.51,107.06 TP5.TESTPOINT
+3V3  (via drill 0.2)
  Top 0.203: U4.1 58.69,109.29 C4.1 59.26,110.92 | U5.5 55.88,104.14 56.39,103.63 56.39,102.62 55.37,101.6 C3.1 54.66,101.02 v53.98,100.33 | R5.2 56.31,100.76 v55.24,99.69 | 59.26,110.92 | 59.26,110.92 v58.42,111.76
  Bottom 0.203: v55.24,99.69 54.61,99.69 v53.98,100.33 | J4.3 59.96,21.59 v60.33,21.59
  pour Top: -4.45,113.66 1.27,119.38 68.58,119.38 74.93,113.03 74.93,1.9 70.48,-2.54 -4.45,-2.54 -6.99,0 -6.99,1.27 -6.99,111.12
+5V
  Top 0.406: TP36.TESTPOINT J6.5V D1.P$1
ANALOG_ACCEL_X
  Top 0.203: TP12.TESTPOINT J6.P0.29 27.74,55.88 C8.1 30.37,56.08 30.6,55.86 33.33,55.86 U1.12
ANALOG_ACCEL_Y
  Top 0.203: TP13.TESTPOINT J6.P0.30 27.74,53.34 C7.1 28.28,53.21 30.25,53.21 30.43,53.38 32.83,53.38 33,53.55 33,53.81 33.47,54.29 U1.10
ANALOG_ACCEL_Z
  Top 0.203: TP14.TESTPOINT J6.P0.31 28.37,50.8 C6.1 31.95,51 32.73,51.77 U1.8
GND  (via drill 0.2)
  Top 0.203: S2.3 S2.4 3.05,108.2 v2.79,108.2 2.55,108.45 D5.C | S3.3 S3.4 2.54,27.43 v2.54,28.58 | U5.2 51.82,103.43 51.82,102.62 v52.58,101.85 52.83,101.6 C3.2 | U4.4 60.69,109.29 C4.2 60.12,110.92 v60.96,111.76 | U2.3 60.38,101.27 60.38,99.82 | 60.38,99.82 C10.2 60.96,100.28 v60.96,100.33 | U2.EP U2.2 59.69,100.51 60.38,99.82 | U1.7 32.08,52.14 31.8,51.87 31.11,51.87 | 30.48,51.87 31.11,51.87 | U1.6 31.43,52.18 31.11,51.87 | U1.5 30.77,52.16 30.48,51.87 | v27.43,52.07 27.63,51.87 C6.2 30.48,51.87 | C8.2 28.78,57.79 v29.21,57.79 29.84,58.42 C5.2 | U1.3 29.03,54.29 28.9,54.41 C7.2 26.98,54.41 v26.92,54.36 | C9.2 26.04,71.55 v26.04,71.37 26.04,71.32 26.77,70.59 | 26.77,70.59 C2.2 26.87,70.28 27.3,69.85 28.5,69.85 29.18,70.52 U3.11 | U3.9 27.5,71.32 26.77,70.59 | C1.2 30.68,74.93 v30.48,74.93 | U3.18 32.75,68.85 33.02,68.58 33.66,68.58 v34.29,69.22 34.29,69.85 33.62,70.52 U3.20
  Top 0.406: J2.MOUNT2 1.76,104.88 v2.54,105.66 | J2.MOUNT3 2.34,89.66 v3.05,89.66 | J2.B 17.56,104.39 v17.78,104.39 | J2.6 16.42,100.08 v18.54,100.08 | J2.MOUNT0 17.78,91.67 v17.78,91.44 | U6.4 24.37,89.68 v23.62,90.42 | C11.2 24.26,97.92 v24.64,98.3 | J2.MOUNT1 12.11,104.82 12.95,105.66 | 12.95,105.66 v14.22,105.66 | S2.3 12.23,106.39 12.95,105.66
  pour Bottom: -5.08,116.84 63.5,116.84 67.31,113.03 67.31,3.81 62.23,-1.27 0,-1.27 -7.62,6.35 -7.62,114.3
GROVE_A0  (via drill 0.2)
  Top 0.203: TP9.TESTPOINT J6.P0.04 12.7,60.96 v13.34,60.33 | v14.61,40.01 14.61,36.83 13.34,35.56 13.34,17.95 J5.1
  Bottom 0.203: v13.34,60.33 14.61,59.05 v14.61,40.01
GROVE_A1  (via drill 0.2)
  Top 0.203: TP10.TESTPOINT J6.P0.03 12.7,63.5 v13.34,62.87 | v15.88,40.01 15.88,36.2 14.61,34.92 14.61,18.69 J5.2
  Bottom 0.203: v13.34,62.87 15.88,60.33 v15.88,40.01
GROVE_D0  (via drill 0.2)
  Top 0.203: TP27.TESTPOINT J6.P0.02 55.12,89.66 45.09,89.66 36.83,81.41 v36.83,81.28 | v36.83,71.12 v36.83,64.77 | v36.83,58.42 36.83,50.8 35.56,49.53 v32.38,49.53 | v32.38,46.99 28.57,43.18 28.57,15.24 30.3,13.51 J7.1
  Bottom 0.203: v36.83,81.28 v36.83,71.12 | v36.83,64.77 v36.83,58.42 | v32.38,49.53 v32.38,46.99
GROVE_D1  (via drill 0.2)
  Top 0.203: TP22.TESTPOINT J6.P0.05 | J7.2 35.83,10.16 47.62,10.16 52.7,15.24 v52.7,16.51
  Bottom 0.203: v52.7,16.51 52.7,29.84 J6.P0.05
LCD_MISO
  Top 0.203: TP17.TESTPOINT J6.P0.16 50.8,68.58 50.8,70.64 A1.13
LCD_MOSI
  Top 0.203: TP15.TESTPOINT J6.P0.15 50.16,66.67 50.16,68.74 A1.14
LCD_SCLK
  Top 0.203: TP19.TESTPOINT J6.P0.17 51.44,70.48 51.44,72.55 A1.12
N$3
  Top 0.203: R4.2 24.05,109.6 18.67,109.6 17.35,110.92 15.98,110.92 14.66,109.6 D5.A
N$4
  Top 0.203: D4.A R3.2
N$5
  Top 0.203: D3.A R2.2
N$7  (via drill 0.2)
  Top 0.203: S1.1 17.78,43.82 v22.86,48.9 | v22.86,54.61 23.18,54.94 U1.2
  Bottom 0.203: v22.86,48.9 v22.86,54.61
N$18
  Top 0.406: R15.2 R9.2 22.66,97.94 C11.1 | J2.4 19.38,97.89 R7.2 21.28,97.92 C11.1 | C11.1 22.68,96.44 25.96,93.17 | 25.96,93.17 R8.2 | 25.96,93.17 26.04,93.09 U6.2 | U6.1 26.98,92.78 26.59,93.17 25.96,93.17
N$19
  Top 0.203: C2.1 28.17,70.92 U3.10
N$25
  Top 0.203: D2.A R1.2
N$50
  cutout Top: 56.52,102.23 50.8,102.23 50.8,107.95 55.88,107.95 57.15,107.95 57.15,110.49 61.59,110.49 61.59,104.14 56.52,104.14
N$51
  cutout Bottom: 56.52,102.23 50.8,102.23 50.8,107.95 57.15,107.95 57.15,110.49 61.59,110.49 61.59,104.14 56.52,104.14
SD_ENABLE  (via drill 0.2)
  Top 0.203: TP28.TESTPOINT J6.P0.26 55.24,92.33 38.99,92.33 v36.2,89.53 | U6.3 25.09,91.25 25.53,90.8 R16.1 29.41,89.97 29.84,89.53 v30.48,89.53
  Bottom 0.203: v30.48,89.53 v36.2,89.53
SD_MISO
  Top 0.203: TP18.TESTPOINT J6.P0.12 52.7,56.52 52.7,57.79 50.16,60.33 24.13,60.33 18.41,66.04 18.41,76.83 12.7,82.55 12.7,99.06 14.83,101.19 J2.7 19.4,101.19 19.81,101.6 R9.1
SD_MOSI  (via drill 0.2)
  Top 0.203: TP16.TESTPOINT J6.P0.11 51.44,55.25 51.44,57.15 48.9,59.69 v26.04,59.69 | R7.1 18.72,96.09 18.03,96.77 16.43,96.77 J2.3 14.88,96.79 13.97,95.88 13.97,83.82 19.68,78.1 19.68,67.31 25.4,61.59 v26.04,61.59
  Bottom 0.203: v26.04,61.59 v26.04,59.69
SD_SCLK
  Top 0.203: TP20.TESTPOINT J6.P0.13 53.98,57.79 50.8,60.96 24.77,60.96 19.05,66.67 19.05,77.47 13.34,83.18 13.34,98.42 13.9,98.99 J2.5
SENSORS_SCL  (via drill 0.2)
  Top 0.203: TP23.TESTPOINT J6.P0.19 53.98,72.64 49.53,77.09 40.01,77.09 35.81,77.09 v34.92,76.2 34.92,72.39 | v60.71,105.16 59.69,104.14 U2.5 | v60.71,105.16 60.71,106.3 U4.3 | U5.6 56.37,105.14 v56.39,105.16 | U3.23 34.26,71.72 34.92,72.39 | J3.1 40.64,16.05 v40.64,58.42 | R11.1 55.35,97.69 | 55.35,97.69 52.53,94.87 37.08,94.87 34.92,92.71 v34.92,81.28 | v60.71,105.16 62.23,103.63 62.23,99.69 60.33,97.79 55.45,97.79 55.35,97.69 | 34.92,72.39 39.37,72.39 40.64,71.12 v40.64,64.77
  Bottom 0.203: v56.39,105.16 v60.71,105.16 | v40.64,58.42 v40.64,64.77 | v34.92,81.28 v34.92,76.2
SENSORS_SDA  (via drill 0.2)
  Top 0.203: TP24.TESTPOINT J6.P0.20 51.44,79.63 34.54,79.63 33.66,78.74 | 58.67,106.17 58.67,106.3 U4.2 | U5.1 53.56,106.17 58.67,106.17 | 58.67,106.17 58.67,104.14 59.04,103.77 U2.6 57.82,103.16 53.77,99.11 R12.1 53.77,97.84 53.34,97.41 36.45,97.41 33.66,94.61 33.66,78.74 | U3.24 33.66,72.52 v33.66,73.66 33.66,78.74 | J3.2 41.91,16.78 v41.91,58.42 | v36.2,73.66 40.64,73.66 41.91,72.39 v41.91,64.77
  Bottom 0.203: v41.91,58.42 v41.91,64.77 | v36.2,73.66 v33.66,73.66
SWITCH_0  (via drill 0.2)
  Top 0.203: TP31.TESTPOINT J6.P0.22 | S5.IN 11.43,20.32 v11.43,22.23 | v16.51,22.23 19.05,24.77 19.05,38.73 v17.78,40.01 | v22.23,67.94 22.23,83.18 24.13,85.09 v30.48,85.09
  Bottom 0.203: v11.43,22.23 v16.51,22.23 | v17.78,40.01 17.78,63.5 v22.23,67.94 | J6.P0.22 49.02,84.58 37.34,84.58 36.83,85.09 v30.48,85.09
UART_RX
  Top 0.203: TP25.TESTPOINT J6.P0.08 49.53,34.29 49.53,21.86 54.61,16.78 J4.2 48.39,8.02 J1.1
UART_TX
  Top 0.203: TP26.TESTPOINT J6.P0.06 50.93,30.61 50.93,22.73 52.2,21.46 56.01,21.46 57.78,19.69 57.78,15.41 55.79,13.42 | J4.1 55.79,13.42 | 55.79,13.42 51.44,9.06 51.44,6.98 50.16,5.71 47.02,5.71 J1.2

### Text on the board
tPlace: RESET | TEMP & / HUMIDITY | POWER | PRESSURE | LIGHT | !LIGHT_INT | SD_EN | GROVE_D0 | SD Card | !LED_0 | !LED_1 | !LED_2 | I2C ACCELEROMETER / GYRO & MAGNETOMETER | SWITCH_0 | SDA | SCL | !LCD_CS | LCD_SCLK | GND | LCD_MISO | GROVE_A1 | LCD_MOSI | GROVE_A0 | !SD_CS | !BUTTON_0 | ANALOG / ACCELEROMETER | ACCEL_X | SD_SCLK | SD_MISO | ACCEL_Y | ACCEL_Z | SD_MOSI | ACCEL / SELF TEST | GND | GND | 0 | 1 | 2 | !IMU_INT | GROVE_D1 | Berkeley Buckler | Branden Ghena | B | BUTTON_0 | August 2018 | GND | GND | GND | GND | 3V3 | 3V3 | 3V3 | 3V3 | A1 | D1 | SDA | RX | A0 | D0 | SCL | TX | SWITCH_0 | GND | GND